# EAGLE design courtyard_distboard (EAGLE 6.6.0)
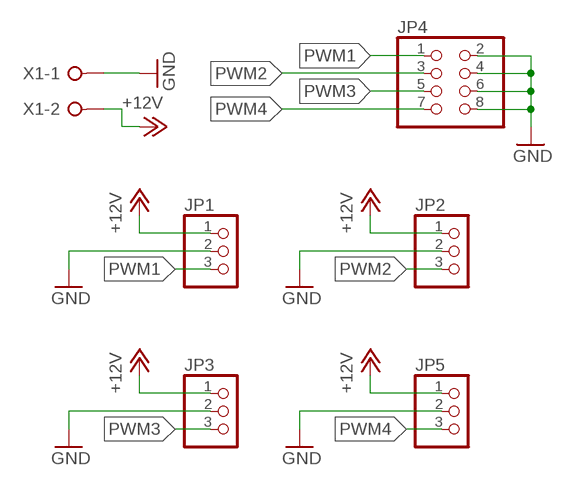
[diagram p0: schematic, sheet 1]

## Parts
JP1  PINHD-1X3  [1X03]
JP2  PINHD-1X3  [1X03]
JP3  PINHD-1X3  [1X03]
JP4  PINHD-2X4  [2X04]
JP5  PINHD-1X3  [1X03]
X1  W237-02P  [W237-132]

## Nets
+12V: JP1.1 JP2.1 JP3.1 JP5.1 X1.2
GND: JP1.2 JP2.2 JP3.2 JP4.2 JP4.4 JP4.6 JP4.8 JP5.2 X1.1
PWM1: JP1.3 JP4.1
PWM2: JP2.3 JP4.3
PWM3: JP3.3 JP4.5
PWM4: JP4.7 JP5.3

## Library data of the parts
JP1-JP3 JP5 = pinhead:PINHD-1X3: PIN HEADER
JP4 = pinhead:PINHD-2X4: PIN HEADER
X1 = con-wago-508:W237-02P: WAGO SREW CLAMP; OC_FARNELL: unknown; OC_NEWARK: unknown

## Board
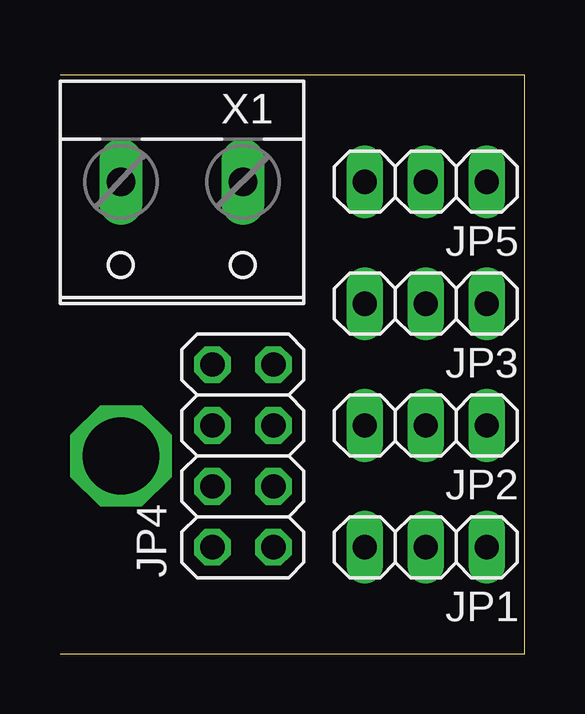
[diagram p1: board, top side]
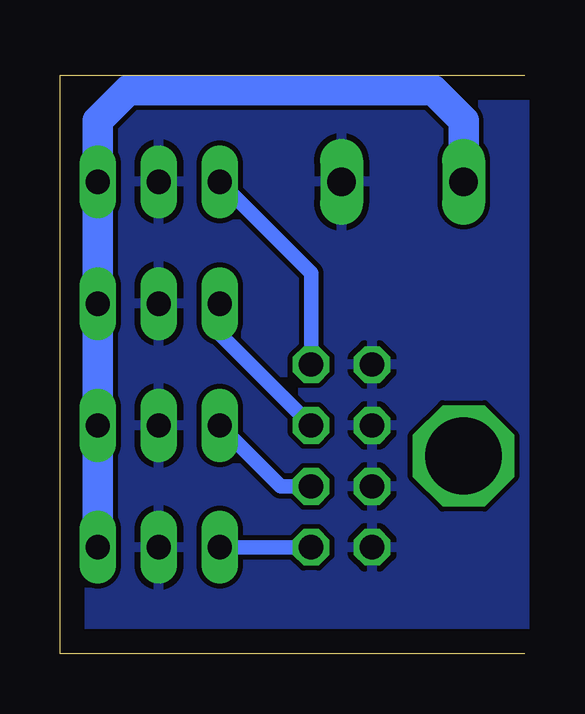
[diagram p2: board, bottom side, seen from below]

Size 19.36 x 24.12 mm. Coordinates in mm from the lower left corner, seen from the top.
Outline: 0,0 19.36,0 19.36,24.12 0,24.12
Copper layers (1*16): Top 0.035mm / dielectric 1.5mm / Bottom 0.035mm
Design rules "default": minimum track width 10mil, minimum drill 24mil, track to track 8mil, track to pad 8mil, pad to pad 8mil, via to via 8mil, smd to smd 8mil, copper to edge 40mil, drill to drill 8mil, minimum pad ring 10mil, minimum via ring 8mil, stop-mask expansion 4mil, vias tented up to drill 0mil, thermal gap 10mil

### Footprints (pad centres in the part's own frame; a part is rotated, then mirrored left to right if it is on the bottom)
1X03 = drill 1.016 long: 1 -2.54,0; 2 0,0; 3 2.54,0
2X04 = drill 1.016 octagon: 1 -3.81,-1.27; 2 -3.81,1.27; 3 -1.27,-1.27; 4 -1.27,1.27; 5 1.27,-1.27; 6 1.27,1.27; 7 3.81,-1.27; 8 3.81,1.27
W237-132 = drill 1.194 long: 1 -2.54,-0.635; 2 2.54,-0.635

### Placement (x,y rotation side)
JP1  15.24,4.45 180 top
JP2  15.24,9.53 180 top
JP3  15.24,14.61 180 top
JP4  7.62,8.26 90 top
JP5  15.24,19.68 180 top
X1  5.08,19.05 180 top

### Tracks (layer width: path | path; a pad name or v marks a point on that pad's centre or on a via)
+12V
  Bottom 1.27: X1.2 2.54,22.23 3.81,23.5 16.51,23.5 17.78,22.23 JP5.1 JP3.1 JP2.1 JP1.1
GND
  pour Bottom: 0,24.13 19.68,24.13 19.68,0 0,0
N$1  (via drill 3.2)
  other vias: 2.54,8.26
PWM1
  Bottom 0.61: JP4.1 JP1.3
PWM2
  Bottom 0.61: JP4.3 10.16,6.99 JP2.3
PWM3
  Bottom 0.61: JP4.5 12.7,13.34 JP3.3
PWM4
  Bottom 0.61: JP4.7 8.89,15.88 JP5.3